# Altium schematic sheet RS232_HIN232.SchDoc: RS232 Communication IC
size A4; Organization: Altium Limited.; DocumentNumber: 29; SheetNumber: 30; SheetTotal: 78
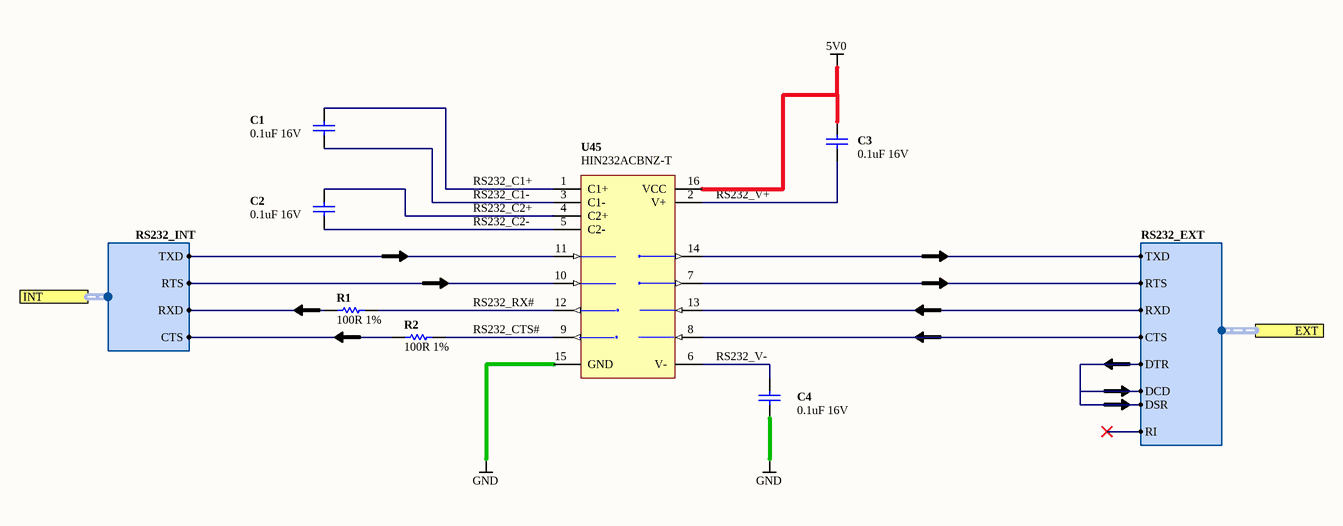
[diagram p0: RS232_HIN232.SchDoc]

## Parts
C1  0.1uF 16V  [CAPC1005-STAR]
C2  0.1uF 16V  [CAPC1005-STAR]
C3  0.1uF 16V  [CAPC1005-STAR]
C4  0.1uF 16V  [CAPC1005-STAR]
R1  100R 1%  [RESC1005-STAR]
R2  100R 1%  [RESC1005-STAR]
U45  HIN232ACBNZ-T  [SOIC127P600-16]

## Ports
EXT (harness RS232_EXT), INT (harness RS232_INT)

## Harnesses
RS232_EXT: DCD, RXD, TXD, DTR, DSR, RTS, CTS, RI
RS232_INT: RXD, TXD, RTS, CTS

## Nets
5V0: C3.1 U45.16(VCC)
GND: C4.2 U45.15(GND)
RS232_C1+: C1.1 U45.1(C1+)
RS232_C1-: C1.2 U45.3(C1-)
RS232_C2+: C2.1 U45.4(C2+)
RS232_C2-: C2.2 U45.5(C2-)
RS232_CTS#: R2.2 U45.9(R2OUT)
RS232_RX#: R1.2 U45.12(R1OUT)
RS232_V+: C3.2 U45.2(V+)
RS232_V-: C4.1 U45.6(V-)
NetR1_1: R1.1 ; port INT.RXD
NetR2_1: R2.1 ; port INT.CTS
NetU45_7: U45.7(T2OUT) ; port EXT.RTS
NetU45_8: U45.8(R2IN) ; port EXT.CTS
NetU45_10: U45.10(T2IN) ; port INT.RTS
NetU45_11: U45.11(T1IN) ; port INT.TXD
NetU45_13: U45.13(R1IN) ; port EXT.RXD
NetU45_14: U45.14(T1OUT) ; port EXT.TXD
(unnamed): port EXT.DCD, port EXT.DTR, port EXT.DSR

## Notes on the sheet
- Sheet Title
- Project Title
- Size:
- Date:
- A4
- Assy:
- Time:
- Revision:
- Sheet
- of
- File:

## Library data of the parts
C1-C4 = D-101-0080: Capacitor, Ceramic, 0.1uF 10% 16V 0402 (1005) X7R; Polarity: Non-Polarized; Category: Capacitor; Capacitance: 0.1 uF; Dielectric: X7R; Mounting Technology: Surface Mount; Rated Voltage: 16 V; Status: Production; Technology: Ceramic; Tolerance: 10 %
R1 R2 = D-100-0131: Resistor, 100R 1% 0402 (1005); Power Rating: 63 mW; Category: Resistor; Mounting Technology: Surface Mount; Resistance: 100 R; Status: Production; Tolerance: 1 %
U45 = D-221-0017: HIN232ACBNZ-T 5V,  True RS-232 Transceivers; Comm Standard: None; Mounting Technology: Surface Mount; Status: Production; Category: IC-Communication